# EAGLE design core2 (EAGLE 6.6.0)

## Sheet 1 of 2
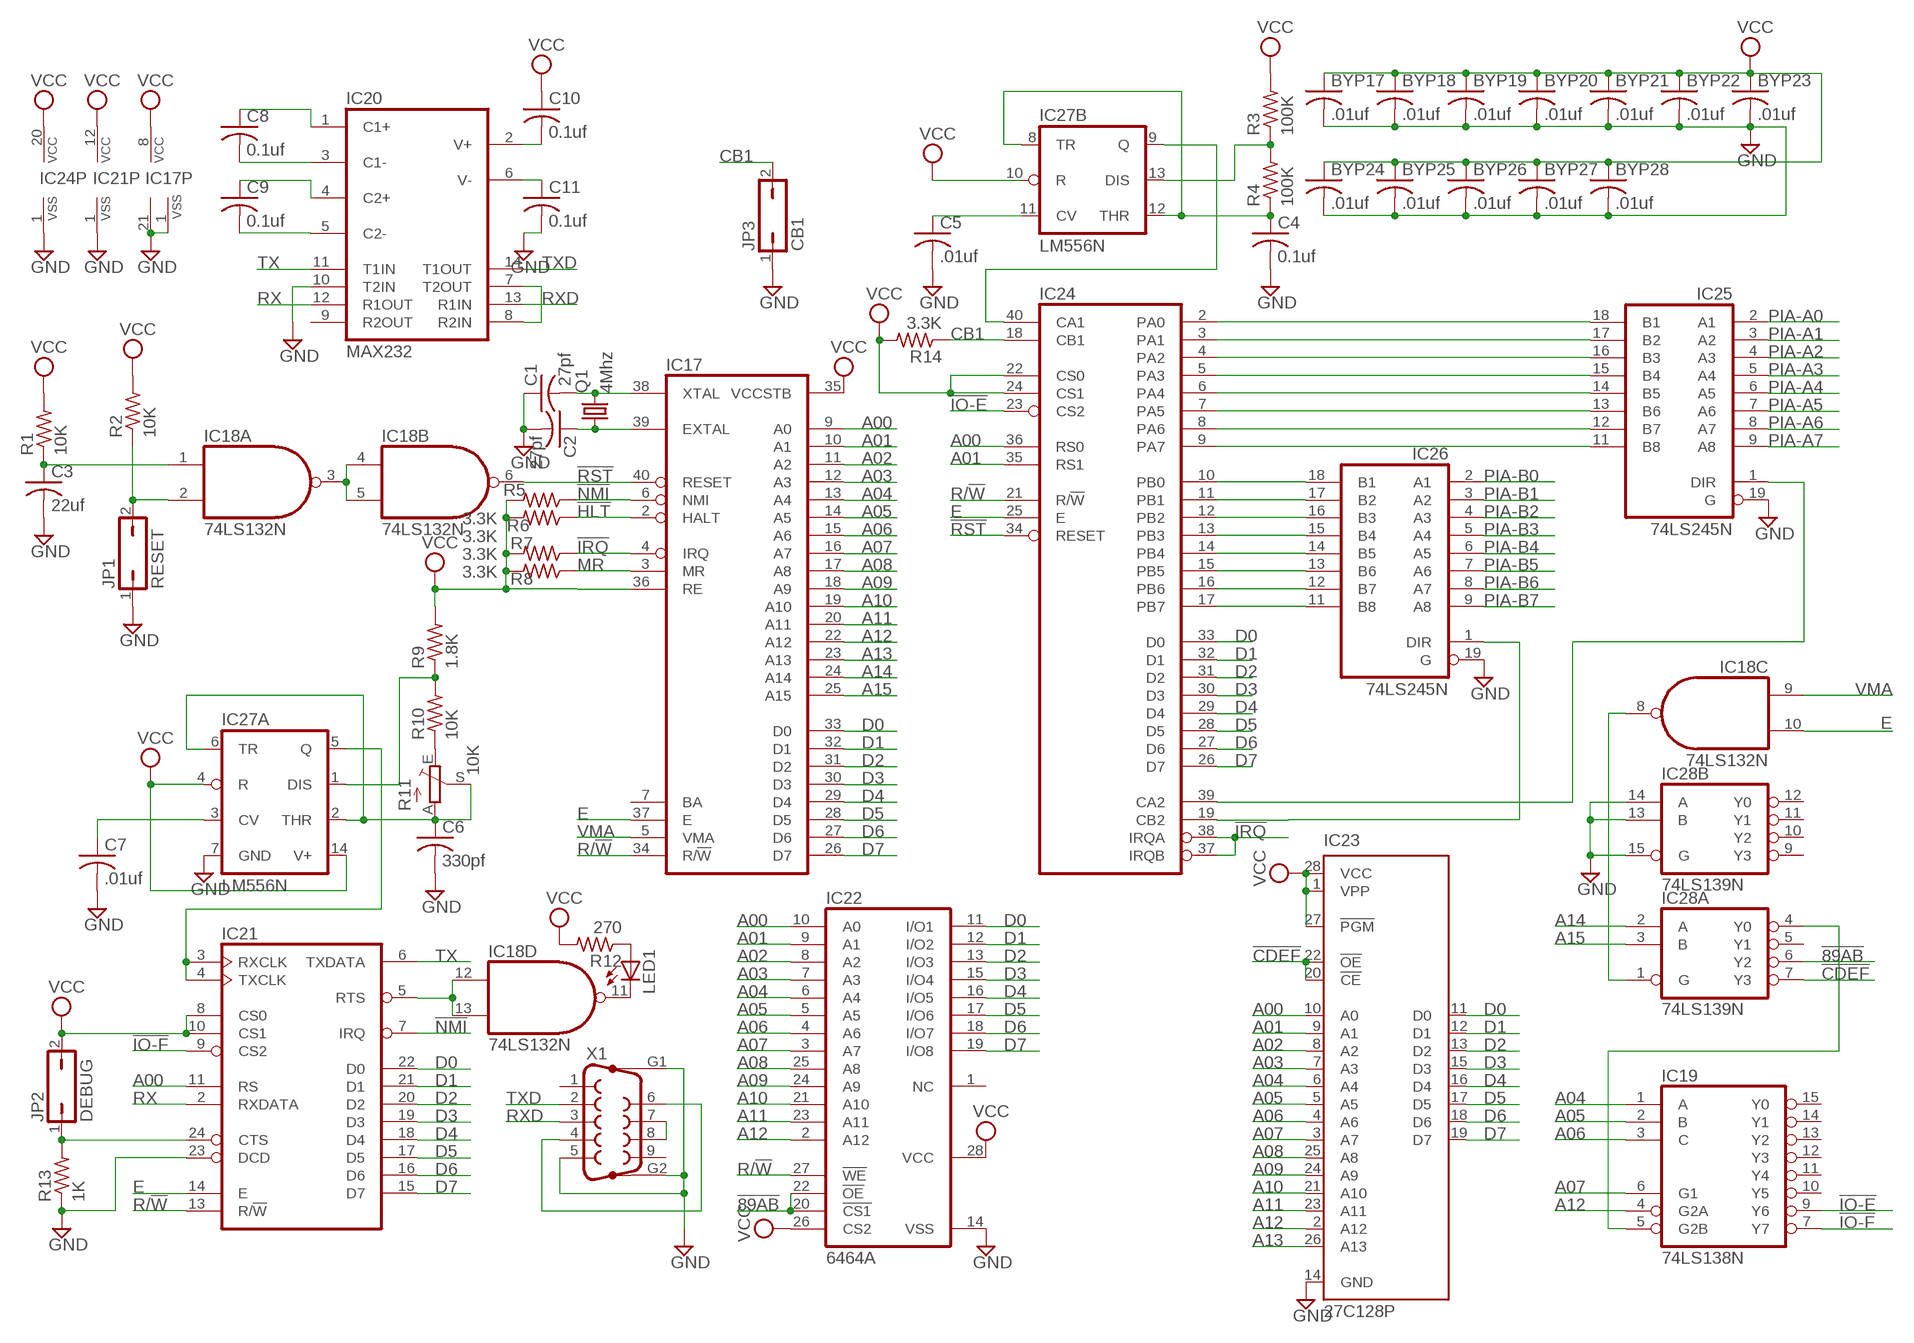
[diagram p0: schematic, sheet 1]

### Parts
BYP17  .01uf  C-US050-025X075  [C050-025X075]
BYP18  .01uf  C-US050-025X075  [C050-025X075]
BYP19  .01uf  C-US050-025X075  [C050-025X075]
BYP20  .01uf  C-US050-025X075  [C050-025X075]
BYP21  .01uf  C-US050-025X075  [C050-025X075]
BYP22  .01uf  C-US050-025X075  [C050-025X075]
BYP23  .01uf  C-US050-025X075  [C050-025X075]
BYP24  .01uf  C-US050-025X075  [C050-025X075]
BYP25  .01uf  C-US050-025X075  [C050-025X075]
BYP26  .01uf  C-US050-025X075  [C050-025X075]
BYP27  .01uf  C-US050-025X075  [C050-025X075]
BYP28  .01uf  C-US050-025X075  [C050-025X075]
C1  27pf  C-US050-025X075  [C050-025X075]
C2  27pf  C-US050-025X075  [C050-025X075]
C3  22uf  C-US102-043X133  [C102-043X133]
C4  0.1uf  C-US050-025X075  [C050-025X075]
C5  .01uf  C-US050-025X075  [C050-025X075]
C6  330pf  C-US050-025X075  [C050-025X075]
C7  .01uf  C-US050-025X075  [C050-025X075]
C8  0.1uf  C-US050-025X075  [C050-025X075]
C9  0.1uf  C-US050-025X075  [C050-025X075]
C10  0.1uf  C-US050-025X075  [C050-025X075]
C11  0.1uf  C-US050-025X075  [C050-025X075]
IC17  6802  [DIL40]
IC18  74LS132N  74LS00N  [DIL14]
IC19  74LS138N  [DIL16]
IC20  MAX232  [DIL16]
IC21  6850  [DIL24]
IC22  6464A  6264A  [DIL28-6]
IC23  27C128P  [DIL28-6]
IC24  6821  [DIL40]
IC25  74LS245N  [DIL20]
IC26  74LS245N  [DIL20]
IC27  LM556N  [DIL14]
IC28  74LS139N  [DIL16]
JP1  RESET  JP1Q  [JP1]
JP2  DEBUG  JP1Q  [JP1]
JP3  CB1  JP1Q  [JP1]
LED1  LED3MM  [LED3MM]
Q1  4Mhz  CRYSTALHC18U-V  [HC18U-V]
R1  10K  R-US_0207/7  [0207/7]
R2  10K  R-US_0207/7  [0207/7]
R3  100K  R-US_0207/7  [0207/7]
R4  100K  R-US_0207/7  [0207/7]
R5  3.3K  R-US_0207/7  [0207/7]
R6  3.3K  R-US_0207/7  [0207/7]
R7  3.3K  R-US_0207/7  [0207/7]
R8  3.3K  R-US_0207/7  [0207/7]
R9  1.8K  R-US_0207/7  [0207/7]
R10  10K  R-US_0207/7  [0207/7]
R11  10K  TRIM_EU-B90P  [SP19L]
R12  270  R-US_0207/7  [0207/7]
R13  1K  R-US_0207/7  [0207/7]
R14  3.3K  R-US_0207/7  [0207/7]
X1  F09HP  [F09HP]

### Nets
!89AB: IC22.20(!CS1) IC22.22(!OE) IC28.6(A:Y2)
!CDEF: IC23.20(!CE) IC23.22(!OE) IC28.7(A:Y3)
!HLT: IC17.2(HALT) R5.1
!IO-E: IC19.9(Y6) IC24.23(CS2)
!IO-F: IC19.7(Y7) IC21.9(CS2)
!IRQ: IC17.4(IRQ) IC24.37(IRQB) IC24.38(IRQA) R7.1
!NMI: IC17.6(NMI) IC21.7(IRQ) R6.1
!RST: IC17.40(RESET) IC18.6(B:O) IC24.34(RESET)
A00: IC17.9(A0) IC21.11(RS) IC22.10(A0) IC23.10(A0) IC24.36(RS0)
A01: IC17.10(A1) IC22.9(A1) IC23.9(A1) IC24.35(RS1)
A02: IC17.11(A2) IC22.8(A2) IC23.8(A2)
A03: IC17.12(A3) IC22.7(A3) IC23.7(A3)
A04: IC17.13(A4) IC19.1(A) IC22.6(A4) IC23.6(A4)
A05: IC17.14(A5) IC19.2(B) IC22.5(A5) IC23.5(A5)
A06: IC17.15(A6) IC19.3(C) IC22.4(A6) IC23.4(A6)
A07: IC17.16(A7) IC19.6(G1) IC22.3(A7) IC23.3(A7)
A08: IC17.17(A8) IC22.25(A8) IC23.25(A8)
A09: IC17.18(A9) IC22.24(A9) IC23.24(A9)
A10: IC17.19(A10) IC22.21(A10) IC23.21(A10)
A11: IC17.20(A11) IC22.23(A11) IC23.23(A11)
A12: IC17.22(A12) IC19.4(G2A) IC22.2(A12) IC23.2(A12)
A13: IC17.23(A13) IC23.26(A13)
A14: IC17.24(A14) IC28.2(A:A)
A15: IC17.25(A15) IC28.3(A:B)
CB1: IC24.18(CB1) JP3.2 R14.1
D0: IC17.33(D0) IC21.22(D0) IC22.11(I/O1) IC23.11(D0) IC24.33(D0)
D1: IC17.32(D1) IC21.21(D1) IC22.12(I/O2) IC23.12(D1) IC24.32(D1)
D2: IC17.31(D2) IC21.20(D2) IC22.13(I/O3) IC23.13(D2) IC24.31(D2)
D3: IC17.30(D3) IC21.19(D3) IC22.15(I/O4) IC23.15(D3) IC24.30(D3)
D4: IC17.29(D4) IC21.18(D4) IC22.16(I/O5) IC23.16(D4) IC24.29(D4)
D5: IC17.28(D5) IC21.17(D5) IC22.17(I/O6) IC23.17(D5) IC24.28(D5)
D6: IC17.27(D6) IC21.16(D6) IC22.18(I/O7) IC23.18(D6) IC24.27(D6)
D7: IC17.26(D7) IC21.15(D7) IC22.19(I/O8) IC23.19(D7) IC24.26(D7)
E: IC17.37(E) IC18.10(C:I1) IC21.14(E) IC24.25(E)
GND [Power]: BYP17.2 BYP18.2 BYP19.2 BYP20.2 BYP21.2 BYP22.2 BYP23.2 BYP24.2 BYP25.2 BYP26.2 BYP27.2 BYP28.2 C1.1 C2.2 C3.2 C4.2 C5.2 C6.2 C7.2 C11.2 IC17.1(VSS) IC17.21(VSS) IC20.10(T2IN) IC21.1(VSS) IC21.23(DCD) IC22.14(VSS) IC23.14(GND) IC24.1(VSS) IC25.19(G) IC26.19(G) IC27.7(A:GND) IC28.13(B:B) IC28.14(B:A) IC28.15(B:G) JP1.1 JP3.1 R13.1 X1.5 X1.G1 X1.G2 ; also sheet 2
MR: IC17.3(MR) R8.1
N$3: C2.1 IC17.39(EXTAL) Q1.1
N$4: C1.2 IC17.38(XTAL) Q1.2
N$5: IC24.2(PA0) IC25.18(B1)
N$6: IC18.3(A:O) IC18.4(B:I0) IC18.5(B:I1)
N$21: C3.1 IC18.1(A:I0) R1.1
N$22: IC18.2(A:I1) JP1.2 R2.1
N$23: IC21.3(RXCLK) IC21.4(TXCLK) IC27.5(A:Q)
N$24: IC24.10(PB0) IC26.18(B1)
N$25: IC24.11(PB1) IC26.17(B2)
N$27: C6.1 IC27.2(A:THR) IC27.6(A:TR) R11.A R11.S
N$28: IC27.1(A:DIS) R9.1 R10.2
N$94: IC24.12(PB2) IC26.16(B3)
N$124: IC24.13(PB3) IC26.15(B4)
N$125: IC24.14(PB4) IC26.14(B5)
N$126: IC24.15(PB5) IC26.13(B6)
N$127: IC24.16(PB6) IC26.12(B7)
N$128: IC24.17(PB7) IC26.11(B8)
N$129: IC24.3(PA1) IC25.17(B2)
N$130: IC24.4(PA2) IC25.16(B3)
N$131: IC24.5(PA3) IC25.15(B4)
N$132: IC24.6(PA4) IC25.14(B5)
N$133: IC24.7(PA5) IC25.13(B6)
N$134: IC24.8(PA6) IC25.12(B7)
N$135: IC24.9(PA7) IC25.11(B8)
N$136: IC24.19(CB2) IC26.1(DIR)
N$137: IC24.39(CA2) IC25.1(DIR)
N$138: IC24.40(CA1) IC27.9(B:Q)
N$140: C4.1 IC27.8(B:TR) IC27.12(B:THR) R4.1
N$141: IC27.13(B:DIS) R3.1 R4.2
N$142: C5.1 IC27.11(B:CV)
N$143: R10.1 R11.E
N$144: X1.4 X1.6
N$145: X1.7 X1.8
N$147: IC18.12(D:I0) IC18.13(D:I1) IC21.5(RTS)
N$148: IC18.11(D:O) LED1.K(C)
N$149: LED1.A R12.1
N$150: IC21.24(CTS) JP2.1 R13.2
N$151: IC18.8(C:O) IC28.1(A:G)
N$152: IC19.5(G2B) IC28.4(A:Y0)
N$153: IC20.7(T2OUT) IC20.8(R2IN)
N$154: C7.1 IC27.3(A:CV)
N$155: C9.2 IC20.5(C2-)
N$156: C9.1 IC20.4(C2+)
N$157: C8.2 IC20.3(C1-)
N$158: C8.1 IC20.1(C1+)
N$159: C11.1 IC20.6(V-)
N$160: C10.2 IC20.2(V+)
PIA-A0: IC25.2(A1) ; also sheet 2
PIA-A1: IC25.3(A2) ; also sheet 2
PIA-A2: IC25.4(A3) ; also sheet 2
PIA-A3: IC25.5(A4) ; also sheet 2
PIA-A4: IC25.6(A5) ; also sheet 2
PIA-A5: IC25.7(A6) ; also sheet 2
PIA-A6: IC25.8(A7) ; also sheet 2
PIA-A7: IC25.9(A8) ; also sheet 2
PIA-B0: IC26.2(A1) ; also sheet 2
PIA-B1: IC26.3(A2) ; also sheet 2
PIA-B2: IC26.4(A3) ; also sheet 2
PIA-B3: IC26.5(A4) ; also sheet 2
PIA-B4: IC26.6(A5) ; also sheet 2
PIA-B5: IC26.7(A6) ; also sheet 2
PIA-B6: IC26.8(A7) ; also sheet 2
PIA-B7: IC26.9(A8) ; also sheet 2
R/!W: IC17.34(R/!W) IC21.13(R/!W) IC22.27(!WE) IC24.21(R/!W)
RX: IC20.12(R1OUT) IC21.2(RXDATA)
RXD: IC20.13(R1IN) X1.3
TX: IC20.11(T1IN) IC21.6(TXDATA)
TXD: IC20.14(T1OUT) X1.2
VCC [Power]: BYP17.1 BYP18.1 BYP19.1 BYP20.1 BYP21.1 BYP22.1 BYP23.1 BYP24.1 BYP25.1 BYP26.1 BYP27.1 BYP28.1 C10.1 IC17.8(VCC) IC17.35(VCCSTB) IC17.36(RE) IC21.8(CS0) IC21.10(CS1) IC21.12(VCC) IC22.26(CS2) IC22.28(VCC) IC23.1(VPP) IC23.27(!PGM) IC23.28(VCC) IC24.20(VCC) IC24.22(CS0) IC24.24(CS1) IC27.4(A:R) IC27.10(B:R) IC27.14(A:V+) JP2.2 R1.2 R2.2 R3.2 R5.2 R6.2 R7.2 R8.2 R9.2 R12.2 R14.2 ; also sheet 2
VMA: IC17.5(VMA) IC18.9(C:I0)
Unconnected: IC17.7(BA) IC19.10(Y5) IC19.11(Y4) IC19.12(Y3) IC19.13(Y2) IC19.14(Y1) IC19.15(Y0) IC20.9(R2OUT) IC22.1(NC) IC28.5(A:Y1) IC28.9(B:Y3) IC28.10(B:Y2) IC28.11(B:Y1) IC28.12(B:Y0) X1.1 X1.9

## Sheet 2 of 2
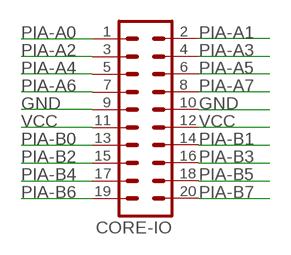
[diagram p1: schematic, sheet 2]

### Parts
CORE-IO  MA10-2  [MA10-2]

### Nets
GND [Power]: CORE-IO.9 CORE-IO.10 ; also sheet 1
PIA-A0: CORE-IO.1 ; also sheet 1
PIA-A1: CORE-IO.2 ; also sheet 1
PIA-A2: CORE-IO.3 ; also sheet 1
PIA-A3: CORE-IO.4 ; also sheet 1
PIA-A4: CORE-IO.5 ; also sheet 1
PIA-A5: CORE-IO.6 ; also sheet 1
PIA-A6: CORE-IO.7 ; also sheet 1
PIA-A7: CORE-IO.8 ; also sheet 1
PIA-B0: CORE-IO.13 ; also sheet 1
PIA-B1: CORE-IO.14 ; also sheet 1
PIA-B2: CORE-IO.15 ; also sheet 1
PIA-B3: CORE-IO.16 ; also sheet 1
PIA-B4: CORE-IO.17 ; also sheet 1
PIA-B5: CORE-IO.18 ; also sheet 1
PIA-B6: CORE-IO.19 ; also sheet 1
PIA-B7: CORE-IO.20 ; also sheet 1
VCC [Power]: CORE-IO.11 CORE-IO.12 ; also sheet 1

## Power pins joined to a net without a drawn wire
GND: IC18.7(P:GND) IC19.8(GND) IC20.15(GND) IC25.10(GND) IC26.10(GND) IC28.8(P:GND)
VCC: IC18.14(P:VCC) IC19.16(VCC) IC20.16(VCC) IC25.20(VCC) IC26.20(VCC) IC28.16(P:VCC)

## Library data of the parts
BYP17-BYP28 C1-C11 = rcl:C-US: CAPACITOR, American symbol
CORE-IO = con-lstb:MA10-2: PIN HEADER; OC_FARNELL: unknown; OC_NEWARK: unknown
IC17 = micro-motorola:6802: MICROCONTROLLER/MEMORY DEVICE; OC_FARNELL: unknown; OC_NEWARK: unknown
IC18 = 74xx-us:74*00: Quad 2-input NAND gate
IC19 = 74xx-us:74*138: 3-line to 8-line DECODER/DEMULTIPLEXER
IC20 = maxim:MAX232: RS232 TRANSCEIVER; MF: MAXIM; MPN: MAX232ACPE+; OC_FARNELL: 9723773; OC_NEWARK: 68K4544
IC21 = micro-motorola:6850: MICROCONTROLLER/MEMORY DEVICE; MF: NTE ELECTRONICS; MPN: NTE6850; OC_FARNELL: 4899775; OC_NEWARK: 31C2457
IC22 = memory-hitachi:6264A: MEMORY; OC_FARNELL: 283605; OC_NEWARK: unknown
IC23 = microchip:27*128: CMOS EPROM 128 K (16 K x 8); OC_FARNELL: unknown; OC_NEWARK: unknown
IC24 = micro-motorola:6821: MICROCONTROLLER/MEMORY DEVICE; MF: NTE ELECTRONICS; MPN: NTE6821; OC_FARNELL: 1652403; OC_NEWARK: 29C4772
IC25 IC26 = 74xx-us:74*245: Octal BUS TRANSCEIVER, 3-state
IC27 = linear:*556: Dual TIMER
IC28 = 74xx-us:74*139: Dual 2-line to 4-line DECODER/DEMULTIPLEXER
JP1-JP3 = jumper:JP1Q: JUMPER
LED1 = led:LED: LED OSRAM: - CHIPLED LG R971, LG N971, LY N971, LG Q971, LY Q971, LO R971, LY R971 LH N974, LH R974 LS Q976, LO Q976, LY Q976 LO Q996 - Hyper CHIPLED LW Q18S LB Q993, LB Q99A, LB R99A - SideLED LS A670, LO A670, LY A670, LG A670, LP A670 LB A673, LV A673, LT A673, LW A673 LH A674 LY A675 LS A676, LA A676, LO A676, LY A676, LW A676 LS A679, LY A679, LG A679 - Hyper Micro SIDELED® LS Y876, LA Y876, LO Y876, LY Y876 LT Y87S - SmartLED LW L88C, LW L88S LB L89C, LB L89S, LG L890 LS L89K, LO L89K, LY L89K LS L896, LA L896, LO L896, LY L896 - TOPLED LS T670, LO T670, LY T670, LG T670, LP T670 LSG T670, LSP T670, LSY T670, LOP T670, LYG T670 LG T671, LOG T671, LSG T671 LB T673, LV T673, LT T673, LW T673 LH T674 LS T676, LA T676, LO T676, LY T676, LB T676, LH T676, LSB T676, LW T676 LB T67C, LV T67C, LT T67C, LS T67K, LO T67K, LY T67K, LW E67C LS E67B, LA E67B, LO E67B, LY E67B, LB E67C, LV E67C, LT E67C LW T67C LS T679, LY T679, LG T679 LS T770, LO T770, LY T770, LG T770, LP T770 LB T773, LV T773, LT T773, LW T773 LH T774 LS E675, LA E675, LY E675, LS T675 LS T776, LA T776, LO T776, LY T776, LB T776 LHGB T686 LT T68C, LB T68C - Hyper Mini TOPLED® LB M676 - Mini TOPLED Santana® LG M470 LS M47K, LO M47K, LY M47K Source: http://www.osram.convergy.de LUXEON: - LUMILED® LXK2-PW12-R00, LXK2-PW12-S00, LXK2-PW14-U00, LXK2-PW14-V00 LXK2-PM12-R00, LXK2-PM12-S00, LXK2-PM14-U00 LXK2-PE12-Q00, LXK2-PE12-R00, LXK2-PE12-S00, LXK2-PE14-T00, LXK2-PE14-U00 LXK2-PB12-K00, LXK2-PB12-L00, LXK2-PB12-M00, LXK2-PB14-N00, LXK2-PB14-P00, LXK2-PB14-Q00 LXK2-PR12-L00, LXK2-PR12-M00, LXK2-PR14-Q00, LXK2-PR14-R00 LXK2-PD12-Q00, LXK2-PD12-R00, LXK2-PD12-S00 LXK2-PH12-R00, LXK2-PH12-S00 LXK2-PL12-P00, LXK2-PL12-Q00, LXK2-PL12-R00 Source: www.luxeon.com KINGBRIGHT: KA-3528ASYC Source: www.kingbright.com
Q1 = crystal:CRYSTAL: CRYSTAL; OC_FARNELL: unknown; OC_NEWARK: unknown
R1-R10 R12-R14 = rcl:R-US_: RESISTOR, American symbol
R11 = pot:TRIM_EU-: POTENTIOMETER
X1 = con-subd:F09HP: SUB-D; OC_FARNELL: unknown; OC_NEWARK: unknown

## Net classes
1 Power: width 0.508 mm, drill 0.254 mm, clearance 0.254 mm

## Board
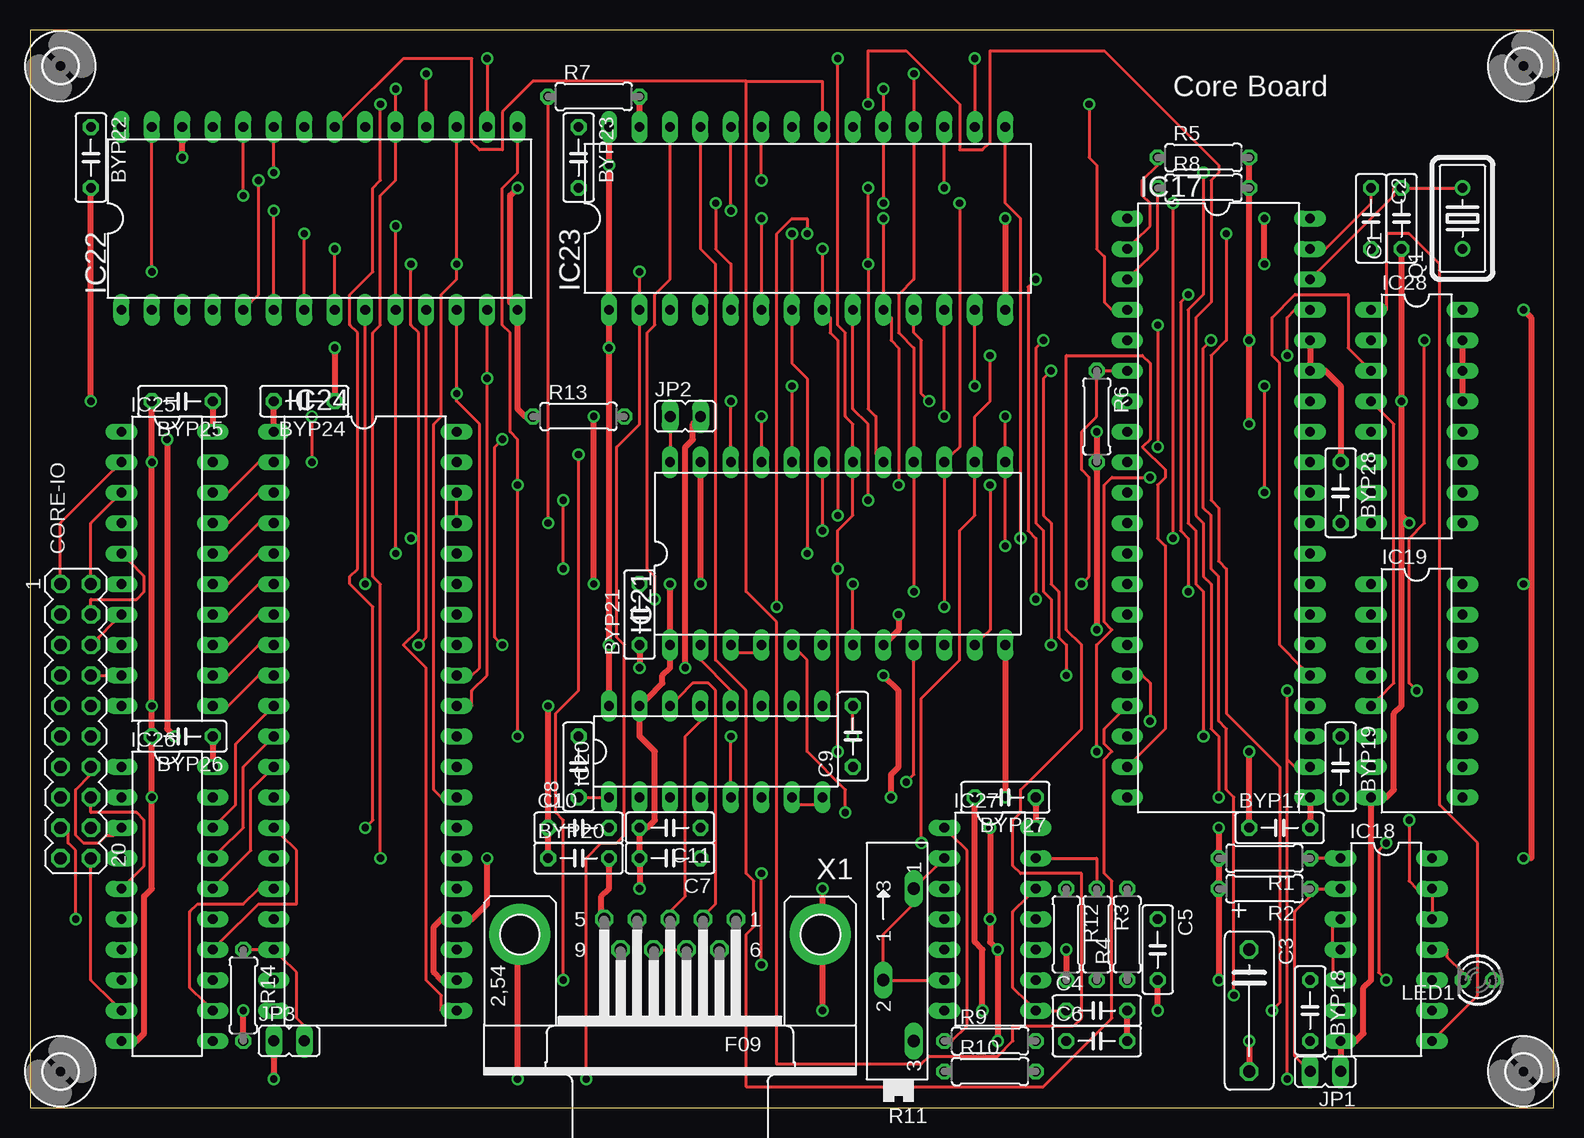
[diagram p2: board, top side]
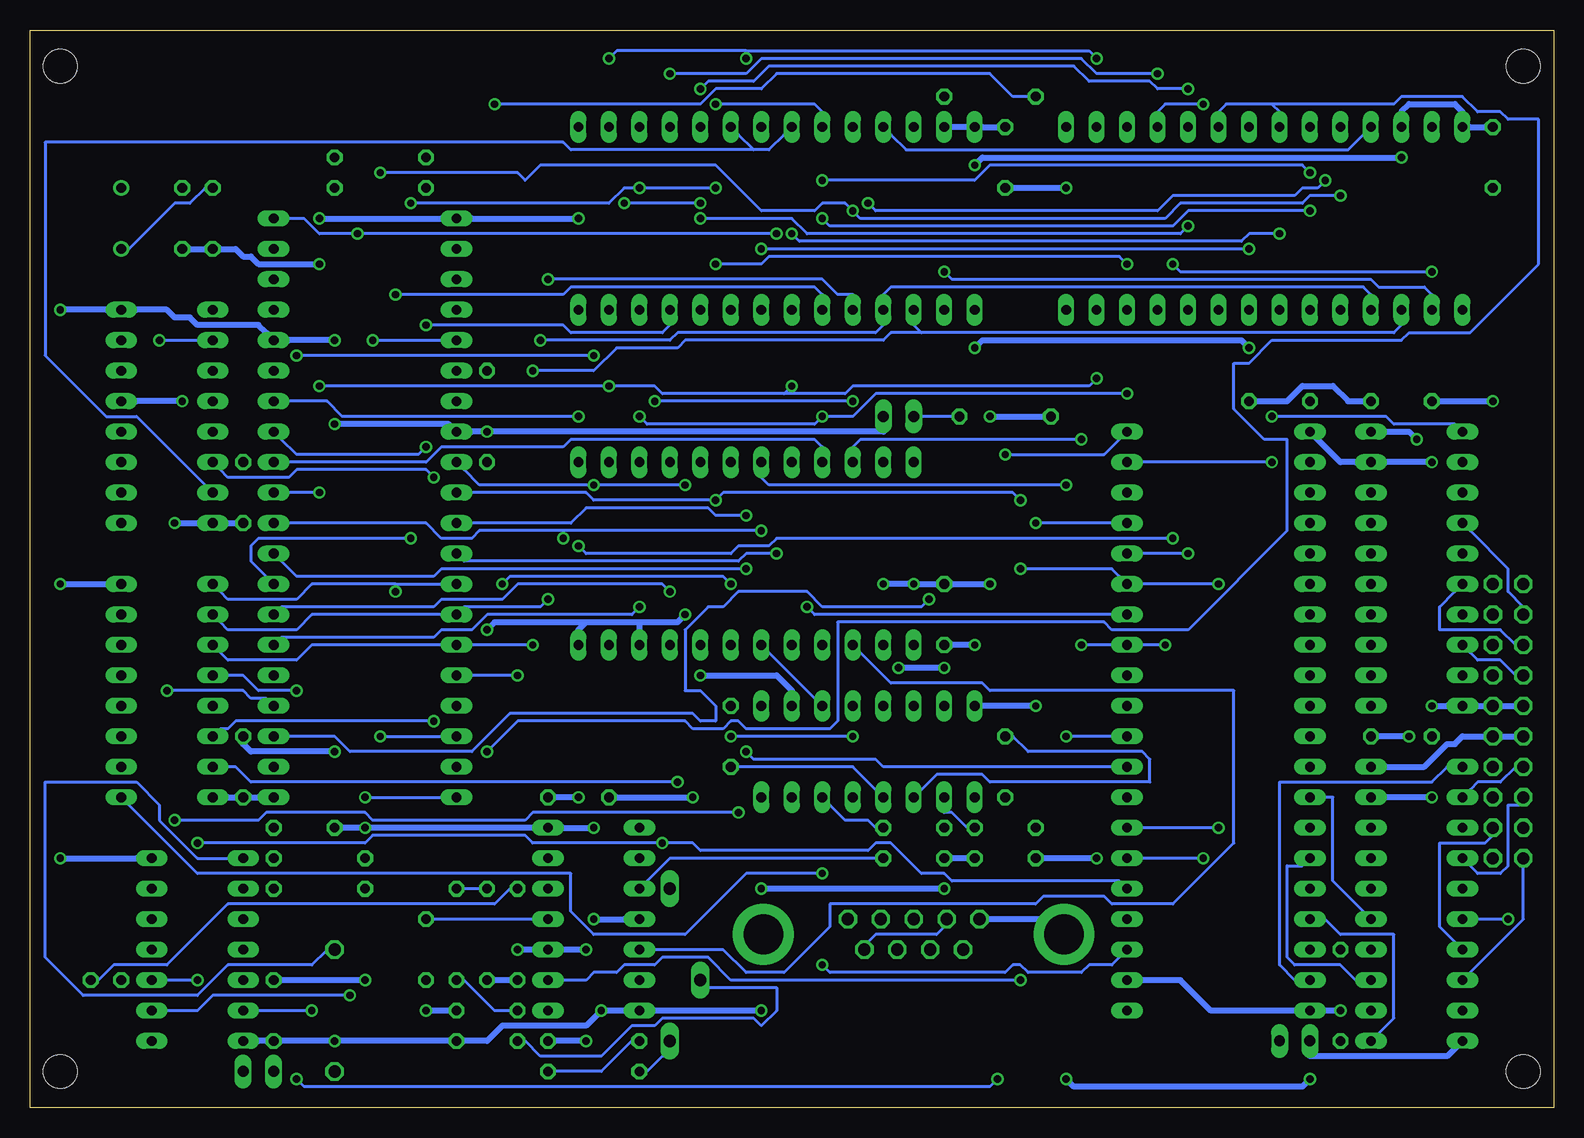
[diagram p3: board, bottom side, seen from below]

Size 126.98 x 89.84 mm. Coordinates in mm from the lower left corner, seen from the top.
Outline: 0,0 126.98,0 126.98,89.84 0,89.84 0,0
Copper layers (1*16): Top 0.035mm / dielectric 1.5mm / Bottom 0.035mm
Design rules "default": minimum track width 10mil, minimum drill 24mil, track to track 8mil, track to pad 8mil, pad to pad 8mil, via to via 8mil, smd to smd 8mil, copper to edge 40mil, drill to drill 8mil, minimum pad ring 10mil, minimum via ring 8mil, stop-mask expansion 4mil, vias tented up to drill 0mil, thermal gap 10mil

### Footprints (pad centres in the part's own frame; a part is rotated, then mirrored left to right if it is on the bottom)
C050-025X075 = drill 0.813 octagon: 1 -2.54,0; 2 2.54,0
C102-043X133 = drill 1.016 octagon: 1 -5.08,0; 2 5.08,0
MA10-2 = drill 1.016 octagon: 1 -11.43,-1.27; 2 -11.43,1.27; 3 -8.89,-1.27; 4 -8.89,1.27; 5 -6.35,-1.27; 6 -6.35,1.27; 7 -3.81,-1.27; 8 -3.81,1.27; 9 -1.27,-1.27; 10 -1.27,1.27; 11 1.27,-1.27; 12 1.27,1.27; 13 3.81,-1.27; 14 3.81,1.27; 15 6.35,-1.27; 16 6.35,1.27; 17 8.89,-1.27; 18 8.89,1.27; 19 11.43,-1.27; 20 11.43,1.27
DIL40 = drill 0.813 long: 1 -24.13,-7.62; 2 -21.59,-7.62; 3 -19.05,-7.62; 4 -16.51,-7.62; 5 -13.97,-7.62; 6 -11.43,-7.62; 7 -8.89,-7.62; 8 -6.35,-7.62; 9 -3.81,-7.62; 10 -1.27,-7.62; 11 1.27,-7.62; 12 3.81,-7.62; 13 6.35,-7.62; 14 8.89,-7.62; 15 11.43,-7.62; 16 13.97,-7.62; 17 16.51,-7.62; 18 19.05,-7.62; 19 21.59,-7.62; 20 24.13,-7.62; 21 24.13,7.62; 22 21.59,7.62; 23 19.05,7.62; 24 16.51,7.62; 25 13.97,7.62; 26 11.43,7.62; 27 8.89,7.62; 28 6.35,7.62; 29 3.81,7.62; 30 1.27,7.62; 31 -1.27,7.62; 32 -3.81,7.62; 33 -6.35,7.62; 34 -8.89,7.62; 35 -11.43,7.62; 36 -13.97,7.62; 37 -16.51,7.62; 38 -19.05,7.62; 39 -21.59,7.62; 40 -24.13,7.62
DIL14 = drill 0.813 long: 1 -7.62,-3.81; 2 -5.08,-3.81; 3 -2.54,-3.81; 4 0,-3.81; 5 2.54,-3.81; 6 5.08,-3.81; 7 7.62,-3.81; 8 7.62,3.81; 9 5.08,3.81; 10 2.54,3.81; 11 0,3.81; 12 -2.54,3.81; 13 -5.08,3.81; 14 -7.62,3.81
DIL16 = drill 0.813 long: 1 -8.89,-3.81; 2 -6.35,-3.81; 3 -3.81,-3.81; 4 -1.27,-3.81; 5 1.27,-3.81; 6 3.81,-3.81; 7 6.35,-3.81; 8 8.89,-3.81; 9 8.89,3.81; 10 6.35,3.81; 11 3.81,3.81; 12 1.27,3.81; 13 -1.27,3.81; 14 -3.81,3.81; 15 -6.35,3.81; 16 -8.89,3.81
DIL24 = drill 0.813 long: 1 -13.97,-7.62; 2 -11.43,-7.62; 3 -8.89,-7.62; 4 -6.35,-7.62; 5 -3.81,-7.62; 6 -1.27,-7.62; 7 1.27,-7.62; 8 3.81,-7.62; 9 6.35,-7.62; 10 8.89,-7.62; 11 11.43,-7.62; 12 13.97,-7.62; 13 13.97,7.62; 14 11.43,7.62; 15 8.89,7.62; 16 6.35,7.62; 17 3.81,7.62; 18 1.27,7.62; 19 -1.27,7.62; 20 -3.81,7.62; 21 -6.35,7.62; 22 -8.89,7.62; 23 -11.43,7.62; 24 -13.97,7.62
DIL28-6 = drill 0.813 long: 1 -16.51,-7.62; 2 -13.97,-7.62; 3 -11.43,-7.62; 4 -8.89,-7.62; 5 -6.35,-7.62; 6 -3.81,-7.62; 7 -1.27,-7.62; 8 1.27,-7.62; 9 3.81,-7.62; 10 6.35,-7.62; 11 8.89,-7.62; 12 11.43,-7.62; 13 13.97,-7.62; 14 16.51,-7.62; 15 16.51,7.62; 16 13.97,7.62; 17 11.43,7.62; 18 8.89,7.62; 19 6.35,7.62; 20 3.81,7.62; 21 1.27,7.62; 22 -1.27,7.62; 23 -3.81,7.62; 24 -6.35,7.62; 25 -8.89,7.62; 26 -11.43,7.62; 27 -13.97,7.62; 28 -16.51,7.62
DIL20 = drill 0.813 long: 1 -11.43,-3.81; 2 -8.89,-3.81; 3 -6.35,-3.81; 4 -3.81,-3.81; 5 -1.27,-3.81; 6 1.27,-3.81; 7 3.81,-3.81; 8 6.35,-3.81; 9 8.89,-3.81; 10 11.43,-3.81; 11 11.43,3.81; 12 8.89,3.81; 13 6.35,3.81; 14 3.81,3.81; 15 1.27,3.81; 16 -1.27,3.81; 17 -3.81,3.81; 18 -6.35,3.81; 19 -8.89,3.81; 20 -11.43,3.81
JP1 = drill 0.914 long: 1 0,-1.27; 2 0,1.27
LED3MM = drill 0.813 octagon: A -1.27,0; K 1.27,0
HC18U-V = drill 0.813: 1 -2.54,0; 2 2.54,0
0207/7 = drill 0.813 octagon: 1 -3.81,0; 2 3.81,0
SP19L = drill 1.016 long: A 5.715,-1.27; E -6.985,-1.27; S -1.905,1.27
2,8 = hole 2.8: 0,0
F09HP = drill 1.016 octagon: 1 -5.486,-1.27; 2 -2.743,-1.27; 3 0,-1.27; 4 2.743,-1.27; 5 5.486,-1.27; 6 -4.115,1.27; 7 -1.372,1.27; 8 1.372,1.27; 9 4.115,1.27 | drill 3.302 pad 5.08: G1 -12.522,0; G2 12.522,0

### Placement (x,y rotation side)
BYP17  104.14,23.33 0 top
BYP18  106.68,8.09 270 top
BYP19  109.22,28.41 270 top
BYP20  45.71,20.79 0 top
BYP21  50.79,41.11 90 top
BYP22  5.08,79.21 270 top
BYP23  45.71,79.21 270 top
BYP24  22.86,58.89 180 top
BYP25  12.69,58.89 180 top
BYP26  12.69,30.95 180 top
BYP27  81.28,25.87 180 top
BYP28  109.22,51.27 270 top
C1  114.3,74.13 90 top
C2  111.76,74.13 270 top
C3  101.59,8.09 270 top
C4  88.9,8.09 0 top
C5  93.98,13.17 270 top
C6  88.9,5.55 0 top
C7  53.34,20.79 180 top
C8  45.71,28.41 90 top
C9  68.58,30.95 90 top
C10  45.71,23.33 0 top
C11  53.34,23.33 180 top
CORE-IO  3.81,32.22 270 top
IC17  99.06,50 270 top
IC18  113.03,13.17 270 top
IC19  115.56,34.76 270 top
IC20  57.14,29.68 0 top
IC21  67.31,46.19 0 top
IC22  24.12,74.13 0 top
IC23  64.77,74.13 0 top
IC24  27.94,32.22 270 top
IC25  11.42,44.92 270 top
IC26  11.42,16.98 270 top
IC27  80.01,15.71 270 top
IC28  115.56,57.62 270 top
JP1  107.95,3.01 90 top
JP2  54.6,57.62 270 top
JP3  21.59,5.55 270 top
LED1  120.65,10.63 180 top
Q1  119.38,74.13 90 top
R1  102.87,20.79 180 top
R2  102.87,18.25 180 top
R3  88.9,14.44 270 top
R4  91.44,14.44 90 top
R5  97.79,79.21 0 top
R6  88.9,57.62 270 top
R7  46.98,84.29 0 top
R8  97.79,76.67 0 top
R9  80.01,5.55 0 top
R10  80.01,3.01 0 top
R11  72.39,12.54 90 top
R12  86.36,14.44 270 top
R13  45.71,57.62 0 top
R14  17.78,9.36 270 top
U$3  [2,8]  2.54,86.83 0 top
U$4  [2,8]  2.54,3.01 0 top
U$5  [2,8]  124.45,86.83 0 top
U$6  [2,8]  124.45,3.01 0 top
X1  53.34,14.44 180 top

### Tracks (layer width: path | path; a pad name or v marks a point on that pad's centre or on a via)
!89AB  (via drill 0.61)
  Top 0.254: v93.34,52.54 90.17,52.54 89.53,51.91 89.53,40.48 90.17,39.84 88.9,38.57 v88.9,29.68
  Bottom 0.254: 23.49,83.66 27.3,83.66 27.94,83.02 IC22.20 | 23.49,83.66 22.86,83.02 IC22.22 | v93.34,52.54 93.98,53.17 104.77,53.17 105.41,52.54 110.48,52.54 111.12,53.17 IC28.6 | v88.9,29.68 86.36,32.22 72.39,32.22 71.75,31.58 69.21,31.58 68.58,32.22 67.94,32.22 67.31,31.58 60.32,31.58 59.68,32.22 59.68,40.48 37.46,40.48 36.82,39.84 30.48,39.84 22.22,48.09 22.22,55.71 24.12,55.71 26.67,58.25 26.67,62.06 25.39,62.06 23.49,63.97 12.69,63.97 12.06,64.61 6.98,64.61 1.27,70.32 1.27,82.39 3.81,82.39 4.44,83.02 6.34,83.02 7.62,84.29 12.69,84.29 13.33,83.66 23.49,83.66
!CDEF
  Bottom 0.254: 66.67,79.84 65.4,79.84 64.13,81.11 IC23.22 | 66.67,79.84 67.94,81.11 IC23.20 | 66.67,79.84 81.91,79.84 82.55,80.48 125.73,80.48 125.73,62.7 120.65,57.62 118.11,57.62 112.39,51.91 IC28.7
!HLT
  Top 0.254: IC17.2 92.07,72.22 93.34,73.5 93.34,75.4 92.7,76.03 92.7,77.3 93.98,78.58 R5.1
!IO-E  (via drill 0.61)
  Top 0.254: v60.95,11.9 v60.95,19.52
  Bottom 0.254: v60.95,11.9 60.32,11.27 45.71,11.27 45.08,11.9 44.45,11.9 43.81,11.27 39.36,11.27 38.73,11.9 36.82,11.9 36.19,12.54 IC24.23 | v60.95,19.52 67.31,19.52 72.39,14.44 80.01,14.44 81.91,16.34 81.91,19.52 113.03,19.52 118.74,25.23 IC19.9
!IO-F  (via drill 0.61)
  Top 0.254: v73.02,27.14 73.66,27.77 73.66,37.3 IC21.9
  Bottom 0.254: v73.02,27.14 108.58,27.14 109.85,28.41 110.48,28.41 IC19.7
!IRQ  (via drill 0.61)
  Top 0.254: IC24.38 35.55,50.63 35.55,49.37 IC24.37 | v43.17,48.73 43.17,83.66 R7.1 | v88.26,83.66 88.26,79.21 88.9,78.58 88.9,71.59 89.53,70.95 89.53,67.14 90.17,66.51 IC17.4
  Bottom 0.254: v43.17,48.73 36.82,48.73 IC24.37 | v88.26,83.66 71.12,83.66 69.84,84.92 66.04,84.92 64.77,86.19 46.98,86.19 45.08,84.29 43.81,84.29 R7.1
!NMI  (via drill 0.61)
  Top 0.254: IC17.6 90.17,61.43 89.53,61.43 R6.1 88.9,60.8 88.9,57.62 87.62,56.35 87.62,53.17 88.26,52.54 88.26,44.28 v87.62,43.65 | v68.58,43.65 68.58,39.84 IC21.7
  Bottom 0.254: v68.58,43.65 69.21,44.28 86.99,44.28 v87.62,43.65
!RST  (via drill 0.61)
  Top 0.254: v62.22,41.74 62.22,72.86 63.49,74.13 64.77,74.13 v64.77,72.86 | v103.5,8.09 104.14,8.73 104.14,28.41 99.69,32.85 99.69,44.92 99.06,45.55 99.06,50 98.42,50.63 98.42,62.7 99.69,63.97 v99.69,72.86
  Bottom 0.254: v62.22,41.74 61.59,41.11 36.82,41.11 IC24.34 | v64.77,72.86 v99.69,72.86 102.87,72.86 104.14,74.13 105.41,74.13 IC17.40 | v103.5,8.09 107.95,8.09 IC18.6
A00  (via drill 0.61)
  Top 0.254: v30.48,46.19 30.48,65.24 IC22.10 30.48,67.78 v30.48,73.5 | v80.01,51.91 80.01,39.84 79.37,39.2 IC21.11 | v72.39,51.91 72.39,63.34 71.75,63.97 71.75,65.88 IC23.10 71.12,67.78 v71.12,74.13
  Bottom 0.254: v30.48,46.19 34.28,46.19 IC24.36 | IC17.9 90.8,53.17 89.53,51.91 v80.01,51.91 v72.39,51.91 | v30.48,73.5 31.11,72.86 62.22,72.86 63.49,74.13 v71.12,74.13
A01  (via drill 0.61)
  Top 0.254: v27.94,43.65 27.94,65.24 IC22.9 | v69.84,50.63 69.84,56.98 68.58,58.25 68.58,65.24 IC23.9 | v44.45,44.92 v44.45,50.63
  Bottom 0.254: v27.94,43.65 34.28,43.65 IC24.35 36.19,44.28 36.82,44.92 v44.45,44.92 | IC17.10 90.17,51.27 80.64,51.27 80.01,50.63 v69.84,50.63 69.21,51.27 45.08,51.27 v44.45,50.63
A02  (via drill 0.61)
  Top 0.254: v25.39,71.59 25.39,67.78 IC22.8 | v66.04,71.59 66.04,67.78 IC23.8 66.67,65.88 66.67,64.61 67.31,63.97 v67.31,49.37
  Bottom 0.254: v25.39,71.59 v66.04,71.59 | v67.31,49.37 69.84,49.37 70.48,50 80.64,50 81.91,48.73 90.17,48.73 IC17.11
A03  (via drill 0.61)
  Top 0.254: v22.86,72.86 22.86,67.78 IC22.7 | v63.49,72.86 63.49,67.78 IC23.7 63.49,65.24 63.49,62.06 64.77,60.8 v64.77,46.19
  Bottom 0.254: v22.86,72.86 25.39,72.86 26.03,72.22 62.86,72.22 v63.49,72.86 | v64.77,46.19 67.31,46.19 67.94,45.55 90.8,45.55 IC17.12
A04  (via drill 0.61)
  Top 0.254: v20.32,74.77 20.32,67.78 IC22.6 | v60.95,74.13 60.95,67.78 IC23.6 | v96.52,43.02 96.52,47.46 95.88,48.09 95.88,67.14 v96.52,67.78
  Bottom 0.254: 96.52,43.65 92.7,43.65 IC17.13 | 96.52,43.65 103.5,43.65 104.77,42.38 110.48,42.38 111.12,43.02 IC19.1 | v20.32,74.77 30.48,74.77 31.75,73.5 60.32,73.5 v60.95,74.13 | v96.52,43.02 96.52,43.65 | v96.52,67.78 82.55,67.78 81.91,68.41 61.59,68.41 60.95,67.78 IC23.6
A05  (via drill 0.61)
  Top 0.254: v19.05,77.3 19.05,67.78 18.41,67.14 IC22.5 | v57.14,75.4 57.14,71.59 58.41,70.32 58.41,67.78 IC23.5 | v83.81,42.38 83.81,47.46 83.18,48.09 83.18,68.41 v83.81,69.05
  Bottom 0.254: IC19.2 111.12,40.48 110.48,39.84 104.77,39.84 103.5,41.11 92.7,41.11 IC17.14 90.8,41.74 84.45,41.74 v83.81,42.38 | v19.05,77.3 19.68,76.67 20.95,76.67 21.59,76.03 31.75,76.03 33.02,74.77 56.51,74.77 v57.14,75.4 | v83.81,69.05 60.95,69.05 59.68,67.78 58.41,67.78 IC23.5
A06  (via drill 0.61)
  Top 0.254: v85.09,38.57 85.09,42.38 84.45,43.02 84.45,48.09 83.81,48.73 83.81,63.34 v84.45,63.97
  Bottom 0.254: IC19.3 111.12,37.94 110.48,37.3 104.77,37.3 103.5,38.57 92.7,38.57 IC17.15 90.17,38.57 v85.09,38.57 | IC22.4 15.23,67.78 15.87,68.41 55.24,68.41 55.88,67.78 IC23.4 55.88,65.24 56.51,64.61 73.02,64.61 73.66,63.97 v84.45,63.97
A07  (via drill 0.61)
  Top 0.254: v93.34,32.22 93.34,35.39 92.7,36.03 IC17.16 | v86.36,36.03 86.36,38.57 85.72,39.2 85.72,43.02 85.09,43.65 85.09,48.73 84.45,49.37 84.45,60.8 v85.09,61.43
  Bottom 0.254: v93.34,32.22 109.85,32.22 110.48,31.58 111.12,31.58 IC19.6 | 52.7,64.61 53.34,65.24 IC23.3 | 52.7,64.61 13.33,64.61 12.69,65.24 IC22.3 | v86.36,36.03 90.17,36.03 IC17.16 | v85.09,61.43 80.01,61.43 78.1,63.34 73.02,63.34 72.39,63.97 55.88,63.97 55.24,64.61 52.7,64.61
A08
  Top 0.254: IC17.17 90.8,32.85 89.53,31.58 89.53,30.31 90.17,29.68 89.53,29.04 89.53,19.52 90.17,18.88 90.17,7.46 84.45,1.74 59.68,1.74 59.68,14.44 60.32,15.08 60.32,18.88 59.68,19.52 59.68,34.76 57.14,37.3 57.14,70.32 55.88,71.59 55.88,80.48 IC23.25
  Bottom 0.254: IC22.25 15.87,81.11 17.14,79.84 53.97,79.84 55.24,81.11 IC23.25
A09  (via drill 0.61)
  Top 0.254: v17.78,76.03 17.78,80.48 IC22.24 | v58.41,74.77 58.41,80.48 IC23.24 | v97.79,30.95 97.79,43.02 97.15,43.65 97.15,48.09 96.52,48.73 96.52,66.51 97.79,67.78 v97.79,77.94
  Bottom 0.254: v17.78,76.03 20.32,76.03 20.95,75.4 31.11,75.4 32.38,74.13 57.78,74.13 v58.41,74.77 59.05,75.4 60.95,75.4 61.59,74.77 66.04,74.77 69.84,78.58 84.45,78.58 85.72,77.3 86.36,77.94 v97.79,77.94 | v97.79,30.95 92.7,30.95 IC17.18
A10
  Top 0.254: 59.68,85.56 66.04,85.56 66.04,83.02 IC23.21 | 59.68,85.56 41.9,85.56 39.36,83.02 39.36,79.84 37.46,79.84 36.82,80.48 36.82,87.47 31.11,87.47 26.03,82.39 IC22.21 | 59.68,85.56 59.68,43.02 62.22,40.48 62.22,3.64 74.29,3.64 74.93,4.28 80.64,4.28 81.91,5.55 81.91,6.82 86.99,6.82 87.62,7.46 87.62,19.52 82.55,19.52 81.91,20.15 81.91,23.96 82.55,24.6 82.55,26.5 87.62,31.58 87.62,38.57 86.36,39.84 86.36,62.7 92.7,62.7 93.34,62.06 93.34,55.71 92.7,55.08 94.61,53.17 94.61,52.54 93.98,51.91 93.98,47.46 94.61,46.82 94.61,31.58 92.07,29.04 IC17.19
A11  (via drill 0.61)
  Top 0.254: v20.32,77.94 20.32,80.48 IC22.23 | v60.95,77.3 60.95,80.48 IC23.23 | v99.06,25.87 99.06,30.95 98.42,31.58 98.42,43.65 97.79,44.28 97.79,48.73 97.15,49.37 97.15,65.88 98.42,67.14 98.42,77.3 99.06,77.94 99.06,78.58 89.53,88.1 80.01,88.1 80.01,80.48 79.37,79.84 77.47,79.84 77.47,83.66 73.02,88.1 69.84,88.1 v69.84,83.66
  Bottom 0.254: v20.32,77.94 20.95,78.58 46.98,78.58 48.25,77.3 v60.95,77.3 | v99.06,25.87 92.7,25.87 IC17.20 | v69.84,83.66 61.59,83.66 60.95,83.02 IC23.23
A12  (via drill 0.61)
  Top 0.254: 104.77,29.04 105.41,28.41 IC17.22 | 104.77,29.04 v104.77,34.76 | v50.79,69.69 50.79,67.78 IC23.2 50.79,65.24 50.79,56.98 48.89,55.08 48.89,39.2 49.52,38.57 49.52,22.7 48.89,22.06 47.62,22.06 46.35,20.79 v46.35,2.38 | v104.77,2.38 104.77,29.04
  Bottom 0.254: v104.77,34.76 107.95,34.76 109.22,36.03 110.48,36.03 IC19.4 | v50.79,69.69 50.16,69.05 15.23,69.05 14.6,68.41 10.79,68.41 10.15,67.78 IC22.2 | v104.77,2.38 104.14,1.74 46.98,1.74 v46.35,2.38
A13  (via drill 0.61)
  Top 0.254: v52.06,42.38 52.06,44.28 51.43,44.92 51.43,64.61 52.06,65.24 52.06,67.78 53.34,69.05 53.34,80.48 IC23.26
  Bottom 0.254: v52.06,42.38 52.7,41.74 60.95,41.74 62.22,43.02 67.94,43.02 69.21,41.74 70.48,41.74 72.39,39.84 72.39,34.76 71.12,34.76 69.84,33.49 69.84,32.22 71.12,32.22 71.75,32.85 86.99,32.85 90.17,29.68 100.33,29.68 101.59,30.95 105.41,30.95 IC17.23
A14  (via drill 0.61)
  Top 0.254: v115.56,34.76 114.93,35.39 114.93,47.46 116.2,48.73 v116.2,63.97
  Bottom 0.254: v115.56,34.76 109.22,34.76 108.58,34.12 107.31,34.12 IC17.24 | v116.2,63.97 113.03,63.97 IC28.2
A15
  Top 0.254: IC17.25 106.04,36.66 104.14,38.57 104.14,62.06 103.5,62.7 103.5,65.88 105.41,67.78 109.85,67.78 109.85,63.34 111.12,62.06 IC28.3
CB1
  Top 0.254: R14.1 18.41,13.17 19.05,13.17 IC24.18 20.95,12.54 22.22,11.27 22.22,7.46 22.86,6.82 JP3.2
D0  (via drill 0.61)
  Top 0.254: v32.38,38.57 33.02,39.2 33.02,65.24 IC22.11 | v58.41,58.89 58.41,55.08 IC21.22 | v74.93,58.89 74.29,59.52 74.29,63.97 73.66,64.61 73.66,65.24 IC23.11 | v93.98,65.24 v93.98,55.08 | v39.36,38.57 38.73,39.2 38.73,55.08 v39.36,55.71
  Bottom 0.254: v32.38,38.57 34.28,38.57 IC24.33 36.82,38.57 v39.36,38.57 | v58.41,58.89 v74.93,58.89 | v93.98,55.08 94.61,54.45 104.77,54.45 106.04,55.71 IC17.33 | v93.98,65.24 82.55,65.24 81.91,64.61 74.29,64.61 73.66,65.24 IC23.11 | v39.36,55.71 57.78,55.71 58.41,55.08 IC21.22
D1  (via drill 0.61)
  Top 0.254: IC22.12 35.55,65.24 v35.55,59.52 35.55,58.89 37.46,56.98 37.46,36.66 36.82,36.03 IC24.32 | v76.2,57.62 76.2,65.24 IC23.12 | v60.95,57.62 60.95,55.08 IC21.21
  Bottom 0.254: IC17.32 105.41,53.81 93.98,53.81 92.7,55.08 82.55,55.08 81.91,55.71 61.59,55.71 60.95,55.08 IC21.21 | v76.2,57.62 75.56,56.98 61.59,56.98 v60.95,57.62 58.41,57.62 56.51,59.52 v35.55,59.52
D2  (via drill 0.61)
  Top 0.254: IC24.31 36.82,33.49 36.82,34.76 38.09,36.03 v38.09,60.8 38.09,65.24 IC22.13 | v63.49,60.16 63.49,55.08 IC21.20 | v78.73,60.16 78.73,65.24 IC23.13 | v102.87,60.16 v102.87,51.27
  Bottom 0.254: 64.13,59.52 v63.49,60.16 | 64.13,59.52 74.29,59.52 74.93,60.16 v78.73,60.16 v102.87,60.16 | v102.87,51.27 105.41,51.27 IC17.31 | v38.09,60.8 38.73,60.16 58.41,60.16 59.05,59.52 64.13,59.52
D3  (via drill 0.61)
  Top 0.254: v40.63,30.95 v40.63,51.91 40.63,55.71 40,56.35 40,64.61 39.36,65.24 39.36,76.67 40.63,77.94 40.63,80.48 IC22.15 | v66.04,48.09 66.04,52.54 IC21.19 | v82.55,47.46 82.55,74.13 81.28,75.4 81.28,80.48 IC23.15
  Bottom 0.254: v40.63,30.95 36.82,30.95 IC24.30 | v40.63,51.91 65.4,51.91 66.04,52.54 IC21.19 | v66.04,48.09 82.55,48.09 | 82.55,48.09 89.53,48.09 90.17,47.46 92.7,47.46 93.98,48.73 105.41,48.73 IC17.30 | 82.55,48.09 v82.55,47.46
D4  (via drill 0.61)
  Top 0.254: v38.09,87.47 38.09,83.02 IC22.16 | v78.73,87.47 78.73,83.02 IC23.16 | v67.31,29.68 v67.31,44.92 67.31,48.09 68.58,49.37 68.58,52.54 IC21.18 68.58,55.08 68.58,56.98 67.94,57.62 67.94,64.61 67.31,65.24 v67.31,87.47
  Bottom 0.254: v38.09,87.47 38.73,88.1 67.31,88.1 | 67.31,88.1 78.1,88.1 v78.73,87.47 | v67.31,29.68 66.67,29.04 56.51,29.04 55.88,28.41 36.82,28.41 IC24.29 | v67.31,44.92 92.7,44.92 93.34,44.28 104.77,44.28 106.04,45.55 IC17.29 | v67.31,87.47 67.31,88.1
D5  (via drill 0.61)
  Top 0.254: IC22.17 35.55,80.48 v35.55,70.32 35.55,69.05 34.28,67.78 34.28,57.62 33.65,56.98 33.65,26.5 34.28,25.87 IC24.28 | v69.84,76.67 v69.84,70.32 69.84,58.25 70.48,57.62 70.48,54.45 IC21.17 | v76.2,76.67 76.2,80.48 IC23.17 | v95.25,75.4 v95.25,47.46
  Bottom 0.254: v69.84,76.67 v76.2,76.67 77.47,76.67 78.73,75.4 v95.25,75.4 | v95.25,47.46 107.95,47.46 108.58,46.82 108.58,45.55 107.31,44.28 IC17.28 | v35.55,70.32 36.19,70.95 65.4,70.95 66.04,70.32 v69.84,70.32
D6  (via drill 0.61)
  Top 0.254: v27.94,23.33 28.57,23.96 28.57,41.74 26.67,43.65 26.67,44.28 27.3,44.92 27.3,64.61 26.67,65.24 26.67,67.78 28.57,69.69 28.57,76.67 29.21,77.3 v29.21,83.66 | v73.66,43.02 73.66,52.54 IC21.16 73.66,55.08 73.66,63.34 72.39,64.61 72.39,67.78 73.66,69.05 73.66,80.48 IC23.18 73.66,83.02 v73.66,86.19 | v33.02,86.19 33.02,83.02 IC22.18
  Bottom 0.254: v27.94,23.33 34.28,23.33 IC24.27 | v29.21,83.66 32.38,83.66 33.02,83.02 IC22.18 | v73.66,43.02 74.29,43.65 86.36,43.65 87.62,42.38 92.7,42.38 93.34,41.74 106.04,41.74 IC17.27 | v33.02,86.19 38.09,86.19 39.36,87.47 66.04,87.47 67.31,86.19 v73.66,86.19
D7  (via drill 0.61)
  Top 0.254: v29.21,20.79 29.21,43.65 28.57,44.28 28.57,64.61 29.21,65.24 29.21,76.03 30.48,77.3 30.48,80.48 IC22.19 30.48,83.02 v30.48,84.92 | v77.47,75.4 77.47,55.08 76.83,54.45 IC21.15 76.2,52.54 v76.2,41.74 | v71.12,75.4 71.12,80.48 IC23.19 71.12,83.02 v71.12,84.92
  Bottom 0.254: v29.21,20.79 34.28,20.79 IC24.26 | v71.12,75.4 v77.47,75.4 | v76.2,41.74 76.83,41.11 88.9,41.11 90.17,39.84 92.7,39.84 93.34,39.2 106.04,39.2 IC17.26 | v30.48,84.92 33.02,84.92 33.65,85.56 38.73,85.56 40,86.83 65.4,86.83 66.67,85.56 70.48,85.56 v71.12,84.92
E  (via drill 0.61)
  Top 0.254: v74.29,22.06 74.29,34.12 77.47,37.3 77.47,48.09 78.73,49.37 78.73,52.54 IC21.14 78.73,55.08 78.73,57.62 80.01,58.89 v80.01,62.7 | v113.03,10.63 112.39,11.27 112.39,21.42 v113.03,22.06 | v104.77,62.7 104.77,65.88 105.41,66.51 IC17.37
  Bottom 0.254: IC24.25 36.19,18.88 50.16,18.88 50.79,19.52 52.7,19.52 55.24,22.06 56.51,22.06 57.14,21.42 71.12,21.42 71.75,22.06 v74.29,22.06 85.09,22.06 85.72,22.7 98.42,22.7 99.06,22.06 v113.03,22.06 | v113.03,10.63 115.56,10.63 IC18.10 | v80.01,62.7 v104.77,62.7
GND  (via drill 0.61)
  Top 0.508: IC24.1 20.32,56.98 20.32,58.25 BYP24.2 | BYP25.2 10.15,58.25 v10.15,53.81 v10.15,33.49 10.15,31.58 BYP26.2 10.15,30.31 v10.15,25.87 10.15,18.25 9.52,17.61 9.52,6.18 8.88,5.55 IC26.10 | v5.08,58.89 5.08,76.03 BYP22.2 | X1.5 47.62,16.34 47.62,17.61 48.25,18.25 48.25,20.15 BYP20.2 | R13.1 41.27,57.62 40.63,58.25 40.63,65.24 IC22.14 40,67.14 40,76.03 v40.63,76.67 | v53.34,43.65 53.34,39.84 IC21.1 53.34,37.3 53.34,36.66 52.7,36.03 52.7,35.39 51.43,34.12 IC20.15 50.79,32.22 50.79,30.95 52.06,29.68 52.06,23.96 51.43,23.33 C11.2 50.79,22.7 50.79,21.42 C7.2 50.79,20.15 v50.79,18.25 | v55.88,43.65 55.88,52.54 IC21.23 | v46.98,43.65 v46.98,57.62 | v71.12,36.03 72.39,34.76 72.39,28.41 71.75,27.77 v71.75,25.87 | v79.37,8.09 79.37,13.17 78.73,13.81 78.73,25.23 BYP27.2 | v66.04,8.09 66.04,12.54 X1.G1 66.04,16.34 v66.04,18.25 | C6.2 91.44,6.18 91.44,7.46 C4.2 | v93.98,8.09 93.98,10 C5.2 | JP1.1 109.22,4.28 109.22,4.92 IC18.7 110.48,5.55 111.12,6.18 111.12,10 111.76,10.63 111.76,25.23 IC19.8 113.03,25.87 113.66,26.5 113.66,32.85 114.3,33.49 114.3,49.37 | v101.59,5.55 101.59,3.64 C3.2 | v81.28,74.13 81.28,67.78 IC23.14 | BYP17.2 106.68,23.96 106.68,25.23 IC17.21 | IC28.13 119.38,59.52 119.38,60.8 IC28.14 119.38,62.06 119.38,63.34 IC28.15 | 114.3,49.37 v114.93,48.73 | 114.3,49.37 v114.3,58.89 114.3,70.95 C1.1 | v102.87,70.32 v102.87,74.13 | v20.32,2.38 20.32,4.28 JP3.1 | v40.63,2.38 40.63,12.54 X1.G2
  Bottom 0.508: v10.15,53.81 13.96,53.81 IC25.19 16.51,53.81 17.78,53.81 19.68,55.71 IC24.1 | v5.08,58.89 9.52,58.89 BYP25.2 | IC26.10 8.25,4.92 8.88,4.28 20.32,4.28 JP3.1 | CORE-IO.9 3.17,33.49 4.44,33.49 CORE-IO.10 5.71,33.49 6.34,33.49 IC25.10 8.88,33.49 v10.15,33.49 | v10.15,25.87 13.96,25.87 IC26.19 | BYP20.2 48.89,20.79 50.16,20.79 C7.2 | X1.5 47.62,15.71 42.54,15.71 X1.G2 | v40.63,76.67 45.08,76.67 BYP23.2 | v55.88,43.65 v53.34,43.65 51.43,43.65 BYP21.2 50.16,43.65 v46.98,43.65 | v46.98,57.62 42.54,57.62 R13.1 | v71.12,36.03 64.77,36.03 63.49,34.76 IC20.10 | v71.75,25.87 78.1,25.87 BYP27.2 | v66.04,8.09 74.93,8.09 IC27.7 77.47,8.09 v79.37,8.09 80.64,6.82 87.62,6.82 88.9,5.55 90.8,5.55 C6.2 92.07,5.55 v101.59,5.55 106.04,5.55 BYP18.2 107.31,5.55 107.95,5.55 IC18.7 | v93.98,8.09 92.07,8.09 C4.2 | v81.28,74.13 90.17,74.13 IC17.1 92.7,74.13 v102.87,74.13 | IC17.21 107.95,25.87 108.58,25.87 BYP19.2 109.85,25.87 110.48,25.87 IC19.8 | C1.1 113.66,71.59 112.39,71.59 C2.2 111.12,71.59 109.85,71.59 109.22,70.95 108.58,70.95 107.95,70.32 v102.87,70.32 | BYP28.2 109.85,48.73 110.48,48.73 IC28.8 113.03,48.73 v114.93,48.73 | v114.3,58.89 118.11,58.89 IC28.13 | v50.79,18.25 v66.04,18.25 | v20.32,2.38 20.95,1.74 40,1.74 v40.63,2.38
MR
  Top 0.254: IC17.3 92.07,69.69 93.98,71.59 93.98,76.03 R8.1
N$3
  Top 0.254: IC17.39 107.95,71.59 111.76,75.4 111.76,76.03 C2.1
  Bottom 0.254: Q1.1 118.74,71.59 114.93,75.4 113.66,75.4 112.39,76.67 C2.1
N$4
  Top 0.254: IC17.38 107.31,69.69 113.66,76.03 113.66,76.67 C1.2 114.93,76.67 118.74,76.67 Q1.2
N$5
  Top 0.254: IC25.18 16.51,51.27 19.05,53.81 IC24.2
N$6
  Top 0.254: IC18.5 108.58,11.27 108.58,12.54 IC18.4 108.58,13.81 108.58,15.08 IC18.3
N$21
  Top 0.254: R1.1 107.31,20.79 107.95,20.79 IC18.1
  Bottom 0.254: C3.1 102.23,13.17 103.5,11.9 110.48,11.9 113.03,9.36 122.55,9.36 125.73,12.54 125.73,27.14 118.11,27.14 116.2,25.23 116.2,23.96 113.03,20.79 110.48,20.79 IC18.1
N$22
  Top 0.254: IC18.2 107.95,18.25 107.31,18.25 R2.1 106.68,17.61 105.41,16.34 105.41,4.28 106.04,3.64 JP1.2
N$23
  Top 0.254: IC21.3 59.05,37.94 60.32,37.94 IC21.4
  Bottom 0.254: IC27.5 74.93,13.17 69.21,13.17 67.31,11.27 64.13,11.27 60.32,15.08 60.32,16.98 43.17,16.98 42.54,17.61 37.46,17.61 36.82,16.98 31.75,16.98 26.67,22.06 26.67,34.76 46.98,34.76 47.62,35.39 55.24,35.39 57.78,37.94 IC21.3
N$24
  Top 0.254: IC26.18 15.87,23.96 17.14,25.23 17.14,30.31 19.68,32.85 IC24.10
N$25
  Top 0.254: IC26.17 15.87,21.42 17.78,23.33 17.78,28.41 19.68,30.31 IC24.11
N$27
  Top 0.254: IC27.2 75.56,20.15 74.29,18.88 R11.A 73.66,16.98 71.12,14.44 71.12,11.9 R11.S 71.75,10.63 74.93,10.63 IC27.6
  Bottom 0.254: C6.1 85.72,5.55 84.45,4.28 79.37,4.28 76.83,6.82 74.93,6.82 74.29,7.46 66.67,7.46 66.04,6.82 64.77,8.09 64.77,10 70.48,10 R11.S
N$28
  Top 0.254: IC27.1 76.83,22.7 78.1,21.42 78.1,6.82 76.83,5.55 R9.1
  Bottom 0.254: R9.1 76.83,5.55 79.37,3.01 83.18,3.01 R10.2
N$94
  Top 0.254: IC26.16 15.87,18.88 18.41,21.42 18.41,26.5 19.68,27.77 IC24.12
N$124
  Bottom 0.254: IC26.15 15.87,16.34 18.41,18.88 18.41,25.87 19.05,25.87 IC24.13
N$125
  Top 0.254: IC26.14 15.87,13.81 19.05,16.98 22.22,16.98 22.22,21.42 20.95,22.7 IC24.14
N$126
  Bottom 0.254: IC26.13 16.51,10.63 17.78,11.9 21.59,11.9 22.22,12.54 22.22,20.15 20.95,20.15 IC24.15
N$127
  Top 0.254: IC26.12 14.6,8.73 13.33,10 13.33,16.34 13.96,16.98 17.78,16.98 19.05,18.25 IC24.16
N$128
  Bottom 0.254: IC26.11 14.6,6.18 13.33,7.46 13.33,14.44 17.78,14.44 19.05,15.71 IC24.17
N$129
  Top 0.254: IC25.17 16.51,48.73 19.05,51.27 IC24.3
N$130
  Top 0.254: IC25.16 16.51,46.19 19.05,48.73 IC24.4
N$131
  Top 0.254: IC25.15 16.51,43.65 19.05,46.19 IC24.5
N$132
  Top 0.254: IC25.14 16.51,41.11 19.05,43.65 IC24.6
N$133
  Top 0.254: IC25.13 16.51,38.57 19.05,41.11 IC24.7
N$134
  Top 0.254: IC25.12 16.51,36.03 19.05,38.57 IC24.8
N$135
  Top 0.254: IC25.11 16.51,33.49 19.05,36.03 IC24.9
N$136
  Bottom 0.254: IC24.19 21.59,10.63 22.86,11.9 22.86,27.14 10.15,27.14 8.88,28.41 IC26.1
N$137  (via drill 0.61)
  Top 0.254: v23.49,57.62 v23.49,53.81
  Bottom 0.254: v23.49,57.62 13.96,57.62 13.33,56.98 8.25,56.98 IC25.1 | v23.49,53.81 34.28,53.81 IC24.39
N$138  (via drill 0.61)
  Top 0.254: v45.71,54.45 45.71,34.76 43.81,32.85 43.81,24.6 44.45,23.96 v44.45,10.63
  Bottom 0.254: v45.71,54.45 37.46,54.45 36.19,55.71 IC24.40 | v44.45,10.63 68.58,10.63 70.48,12.54 74.29,12.54 74.93,11.9 77.47,11.9 78.1,11.27 80.01,11.27 80.64,10.63 82.55,10.63 IC27.9
N$140
  Top 0.254: C4.1 85.72,8.09 85.09,8.09 IC27.8 83.18,8.73 81.91,10 81.91,16.34 83.18,17.61 IC27.12
  Bottom 0.254: R4.1 90.8,10.63 88.26,8.09 86.99,8.09 C4.1
N$141
  Top 0.254: IC27.13 85.09,20.79 88.9,20.79 88.9,18.88 R3.1
  Bottom 0.254: R3.1 89.53,18.25 90.8,18.25 R4.2
N$142
  Bottom 0.254: IC27.11 85.09,15.71 93.34,15.71 C5.1
N$143
  Bottom 0.254: R10.1 75.56,3.01 74.29,4.28 73.66,4.28 R11.E
N$144
  Bottom 0.254: X1.4 50.79,15.08 51.43,14.44 56.51,14.44 57.14,13.81 X1.6
N$145
  Top 0.254: X1.8 52.7,13.17 53.97,13.17 X1.7
N$147  (via drill 0.61)
  Top 0.254: IC18.12 116.84,16.34 116.84,17.61 IC18.13 115.56,18.25 114.93,18.88 v114.93,23.96 | v67.94,24.6 67.94,26.5 64.77,29.68 64.77,37.3 64.13,37.94 IC21.5
  Bottom 0.254: v67.94,24.6 85.09,24.6 85.72,23.96 98.42,23.96 99.06,24.6 107.31,24.6 107.95,23.96 v114.93,23.96
N$148
  Top 0.254: LED1.K 119.38,11.27 118.11,12.54 118.11,13.17 IC18.11
N$149
  Bottom 0.254: R12.1 86.99,18.25 88.26,16.98 110.48,16.98 115.56,11.9 120.01,11.9 121.28,10.63 LED1.A
N$150
  Top 0.254: IC21.24 53.34,55.08 53.34,56.35 JP2.1
  Bottom 0.254: R13.2 50.16,57.62 52.7,57.62 JP2.1
N$151
  Top 0.254: IC18.8 117.47,6.18 120.65,9.36 120.65,22.06 117.47,25.23 117.47,70.32 114.93,72.86 113.03,72.86 113.03,66.51 IC28.1
N$152
  Top 0.254: IC19.5 112.39,34.12 113.66,35.39 113.66,56.98 112.39,58.25 IC28.4
N$153
  Top 0.254: IC20.7 64.13,25.23 65.4,25.23 IC20.8
N$154
  Bottom 0.254: C7.1 56.51,20.79 73.66,20.79 75.56,18.88 IC27.3
N$155  (via drill 0.61)
  Top 0.254: v58.41,30.95 58.41,27.14 IC20.5 | v68.58,30.95 68.58,32.85 C9.2
  Bottom 0.254: v58.41,30.95 v68.58,30.95
N$156
  Bottom 0.254: IC20.4 56.51,26.5 58.41,28.41 67.94,28.41 C9.1
N$157
  Bottom 0.254: C8.2 45.08,30.95 43.81,29.68 34.28,29.68 33.65,29.04 33.65,27.14 46.98,27.14 47.62,27.77 51.43,27.77 52.7,26.5 IC20.3
N$158
  Top 0.254: C8.1 46.35,25.87 47.62,25.87 IC20.1
N$159
  Bottom 0.254: C11.1 56.51,23.33 57.14,23.96 59.05,23.96 60.32,25.23 IC20.6
N$160
  Bottom 0.254: C10.2 48.89,23.33 50.16,24.6 50.79,24.6 IC20.2
PIA-A0
  Top 0.254: IC25.2 6.98,53.17 2.54,48.73 2.54,44.28 CORE-IO.1
PIA-A1
  Top 0.254: IC25.3 6.98,50.63 5.08,48.73 5.08,44.28 CORE-IO.2
PIA-A2
  Bottom 0.254: IC25.4 6.98,48.09 3.81,44.92 3.81,43.02 2.54,41.74 CORE-IO.3
PIA-A3
  Top 0.254: IC25.5 8.25,45.55 9.52,44.28 9.52,43.02 8.88,42.38 5.08,42.38 5.08,41.74 CORE-IO.4
PIA-A4
  Bottom 0.254: IC25.6 8.25,43.02 9.52,41.74 9.52,39.84 4.44,39.84 3.17,38.57 CORE-IO.5
PIA-A5
  Top 0.254: IC25.7 6.98,40.48 5.71,39.2 5.71,38.57 CORE-IO.6
PIA-A6
  Bottom 0.254: IC25.8 6.98,37.94 6.34,37.3 4.44,37.3 3.17,36.03 CORE-IO.7
PIA-A7
  Top 0.254: IC25.9 6.34,36.03 5.71,36.03 CORE-IO.8
PIA-B0
  Bottom 0.254: IC26.2 6.98,26.5 6.34,27.14 4.44,27.14 3.17,28.41 CORE-IO.13
PIA-B1
  Top 0.254: IC26.3 6.98,22.7 6.34,22.7 5.71,22.06 4.44,22.06 3.81,22.7 3.81,26.5 5.08,27.77 CORE-IO.14
PIA-B2
  Bottom 0.254: IC26.4 6.98,20.15 6.34,19.52 4.44,19.52 3.81,20.15 3.81,25.23 2.54,25.23 CORE-IO.15
PIA-B3
  Top 0.254: IC26.5 8.25,18.88 9.52,20.15 9.52,23.96 8.88,24.6 5.08,24.6 5.08,25.23 CORE-IO.16
PIA-B4  (via drill 0.61)
  Top 0.254: v3.81,15.71 3.81,21.42 3.17,22.06 3.17,23.33 CORE-IO.17
  Bottom 0.254: v3.81,15.71 6.34,15.71 IC26.6
PIA-B5
  Bottom 0.254: IC26.7 8.25,13.81 9.52,15.08 9.52,22.06 5.71,22.06 5.08,22.7 CORE-IO.18
PIA-B6
  Bottom 0.254: IC26.8 6.98,11.27 2.54,15.71 2.54,20.15 CORE-IO.19
PIA-B7
  Top 0.254: IC26.9 6.98,8.73 5.08,10.63 5.08,20.15 CORE-IO.20
R/!W  (via drill 0.61)
  Top 0.254: v81.28,57.62 81.28,55.08 IC21.13 81.28,52.54 v81.28,46.82 | 32.38,47.46 32.38,64.61 31.75,65.24 v31.75,70.32 | 32.38,47.46 32.38,39.84 31.11,38.57 33.02,36.66 33.02,10.63 34.28,9.36 34.28,8.09 IC24.21 | v10.15,69.69 10.15,80.48 IC22.27 | 32.38,47.46 v31.75,47.46
  Bottom 0.254: v81.28,57.62 100.96,57.62 102.23,58.89 105.41,58.89 IC17.34 | v31.75,70.32 31.11,69.69 v10.15,69.69 | v81.28,46.82 80.64,46.19 68.58,46.19 67.94,46.82 65.4,46.82 64.77,47.46 v31.75,47.46
RX
  Top 0.254: IC20.12 58.41,34.76 55.88,37.3 IC21.2
RXD
  Top 0.254: IC20.13 55.88,32.22 54.6,30.95 54.6,17.61 53.34,16.34 X1.3
TX
  Bottom 0.254: IC20.11 61.59,34.12 65.4,37.94 IC21.6
TXD
  Top 0.254: IC20.14 53.97,34.12 55.24,35.39 56.51,35.39 57.14,34.76 57.14,16.98 56.51,16.34 X1.2
VCC  (via drill 0.61)
  Top 0.508: IC25.20 15.23,56.98 15.23,58.25 BYP25.1 | IC26.20 15.23,29.04 15.23,30.31 BYP26.1 | v11.42,55.71 11.42,31.58 v12.06,30.95 | v17.78,8.09 17.78,6.18 R14.2 | IC24.22 34.28,10.63 33.65,11.27 33.65,15.08 34.28,15.71 IC24.24 36.82,15.71 38.09,16.98 v38.09,20.79 | BYP20.1 43.17,21.42 43.17,22.7 C10.1 43.17,23.96 v43.17,33.49 | IC20.16 48.25,34.76 v48.25,38.57 v48.25,63.34 48.25,65.24 IC23.1 48.25,67.78 v48.25,78.58 48.25,80.48 IC23.28 | R7.2 50.79,83.66 50.79,83.02 IC23.27 | v12.69,79.21 12.69,80.48 IC22.26 | v25.39,63.34 25.39,59.52 BYP24.1 | R5.2 101.59,78.58 101.59,77.3 R8.2 101.59,76.03 v101.59,63.97 v101.59,56.98 | IC17.36 106.68,63.34 106.68,62.06 IC17.35 107.95,61.43 109.22,60.16 109.22,54.45 BYP28.1 | v124.45,20.79 125.09,20.79 125.09,43.65 | 125.09,43.65 125.09,65.88 v124.45,66.51 | 125.09,43.65 v124.45,43.65 | v88.9,56.35 88.9,54.45 R6.2 88.9,53.17 v88.9,39.84 | v80.64,5.55 v80.64,13.17 80.01,13.81 v80.01,15.71 v80.01,23.33 | v86.36,13.17 86.36,11.27 R12.2 | v99.06,10.63 99.06,17.61 R2.2 99.06,18.88 99.06,20.15 R1.2 99.06,21.42 v99.06,23.33 | v72.39,41.11 72.39,39.84 71.75,39.2 IC21.8 | IC27.14 83.81,23.96 83.81,25.23 BYP27.1 | v101.59,29.68 101.59,23.96 BYP17.1 | v81.28,25.87 81.28,37.3 IC21.12 | v50.79,36.66 50.79,37.94 BYP21.1 | v54.6,36.66 54.6,55.08 55.24,55.71 55.24,56.98 JP2.2
  Bottom 0.508: BYP24.1 24.76,58.89 22.22,58.89 20.95,60.16 18.41,60.16 17.14,58.89 15.87,58.89 BYP25.1 | CORE-IO.11 3.17,30.95 4.44,30.95 CORE-IO.12 5.71,30.95 7.62,30.95 8.25,30.31 8.88,30.31 10.79,28.41 13.96,28.41 IC26.20 | v11.42,55.71 12.06,56.35 13.96,56.35 IC25.20 | v12.06,30.95 14.6,30.95 BYP26.1 | v17.78,8.09 19.05,8.09 IC24.20 21.59,8.09 28.57,8.09 31.11,10.63 34.28,10.63 IC24.22 | v48.25,38.57 50.16,38.57 BYP21.1 | v43.17,33.49 47.62,33.49 IC20.16 | BYP22.1 5.71,81.75 6.98,81.75 IC22.28 7.62,83.02 8.25,83.66 12.06,83.66 12.69,83.02 IC22.26 | BYP23.1 46.35,81.75 47.62,81.75 IC23.28 48.89,81.75 50.16,81.75 IC23.27 | v12.69,79.21 47.62,79.21 v48.25,78.58 | v38.09,20.79 42.54,20.79 BYP20.1 | v25.39,63.34 26.03,63.97 47.62,63.97 v48.25,63.34 | v101.59,63.97 105.41,63.97 IC17.36 107.31,64.61 107.95,65.24 113.03,65.24 113.66,65.88 114.93,65.88 115.56,66.51 118.11,66.51 IC28.16 120.65,66.51 v124.45,66.51 | v124.45,20.79 118.11,20.79 IC18.14 | v124.45,43.65 120.65,43.65 IC19.16 | JP2.2 55.88,56.35 v88.9,56.35 90.17,56.35 IC17.8 92.07,56.98 v101.59,56.98 | R12.2 86.99,10.63 88.26,10.63 R3.2 | v80.64,5.55 83.18,5.55 R9.2 | v80.64,13.17 82.55,13.17 IC27.10 85.09,13.17 v86.36,13.17 | v80.01,15.71 77.47,15.71 IC27.4 | v99.06,10.63 106.04,10.63 BYP18.1 | v72.39,41.11 73.02,40.48 76.2,40.48 | 76.2,40.48 76.2,39.84 IC21.10 | 80.64,40.48 81.28,39.84 IC21.12 | 80.64,40.48 76.2,40.48 | BYP17.1 100.96,23.33 v99.06,23.33 85.09,23.33 IC27.14 82.55,23.33 v80.01,23.33 | v101.59,29.68 108.58,29.68 109.22,30.31 BYP19.1 | v81.28,25.87 83.18,25.87 BYP27.1 | v88.9,39.84 88.26,40.48 80.64,40.48
  Bottom 0.508: v50.79,36.66 v54.6,36.66
VMA  (via drill 0.61)
  Top 0.254: v100.33,9.36 100.33,25.87 99.69,26.5 99.69,31.58 99.06,32.22 99.06,44.28 98.42,44.92 98.42,49.37 97.79,50 97.79,63.34 v98.42,63.97
  Bottom 0.254: v100.33,9.36 111.76,9.36 113.03,8.09 115.56,8.09 IC18.9 | v98.42,63.97 92.7,63.97 IC17.5

### Text on the board
tPlace: Core Board | +